# EAGLE design rgb_firefly_20090522_v2.3 (EAGLE 5.04)
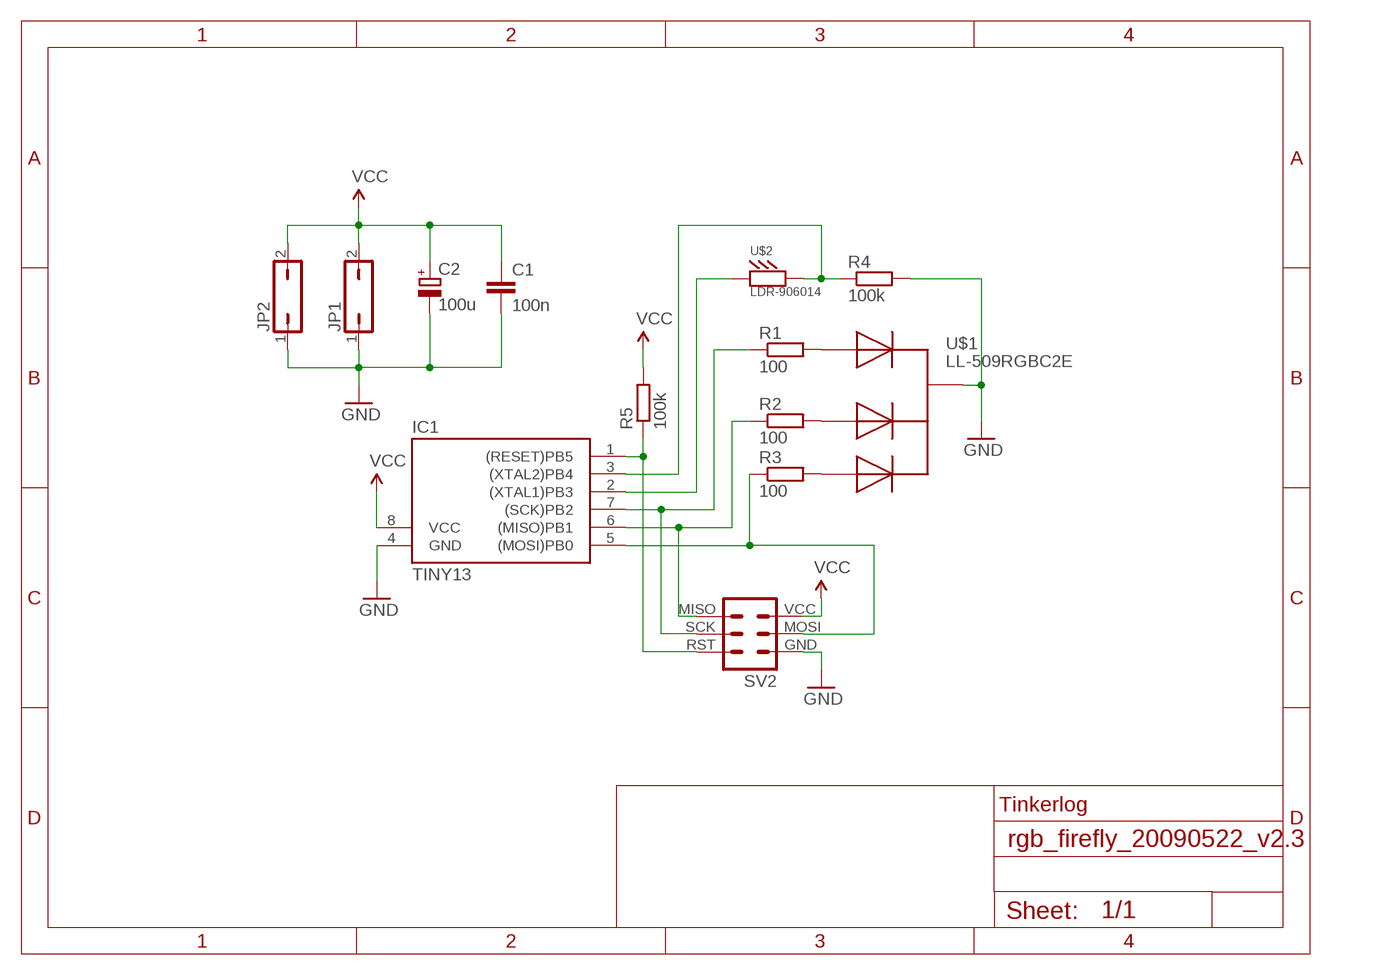
[diagram p0: schematic, sheet 1]

## Parts
C1  100n  C-EU025-025X050  [C025-025X050]
C2  100u  CPOL-EUE2,5-6E  [E2,5-6E]
IC1  TINY13  TINY12P  [DIL08]
JP1  JP1Q  [JP1]
JP2  JP1Q  [JP1]
R1  100  R-EU_0207/10  [0207/10]
R2  100  R-EU_0207/10  [0207/10]
R3  100  R-EU_0207/10  [0207/10]
R4  100k  R-EU_0207/10  [0207/10]
R5  100k  R-EU_0207/10  [0207/10]
SV2  MA03-2  [MA03-2]
U$1  LL-509RGBC2E  [LL-509RGBC2EB]
U$2  LDR-906014  [LDR-906014]

## Nets
GND: C1.2 C2.- IC1.4(GND) JP1.1 JP2.1 R4.2 SV2.GND U$1.P$4(GND)
N$1: R1.2 U$1.P$2(B)
N$2: R2.2 U$1.P$5(R)
N$3: R3.2 U$1.P$3(G)
N$6: IC1.2((XTAL1)PB3) U$2.P$1
N$7: IC1.5((MOSI)PB0) R3.1 SV2.MOSI
N$8: IC1.6((MISO)PB1) R2.1 SV2.MISO
N$9: IC1.7((SCK)PB2) R1.1 SV2.SCK
N$10: IC1.3((XTAL2)PB4) R4.1 U$2.P$2
N$12: IC1.1((RESET)PB5) R5.1 SV2.RST
VCC: C1.1 C2.+ IC1.8(VCC) JP1.2 JP2.2 R5.2 SV2.VCC

## Notes on the sheet
- Tinkerlog

## Library data of the parts
C1 = alex:C-EU: CAPACITOR, European symbol
C2 = rcl:CPOL-EU: POLARIZED CAPACITOR, European symbol
IC1 = atmel:TINY12*: MICROCONTROLLER 1 Kbytes FLASH 64 bytes EEPROM
JP1 JP2 = jumper:JP1Q: JUMPER
R1-R5 = alex:R-EU_: RESISTOR, European symbol
SV2 = alex:MA03-2: PIN HEADER
U$1 = alex:LL-509RGBC2E
U$2 = alex:LDR-906014

## Board
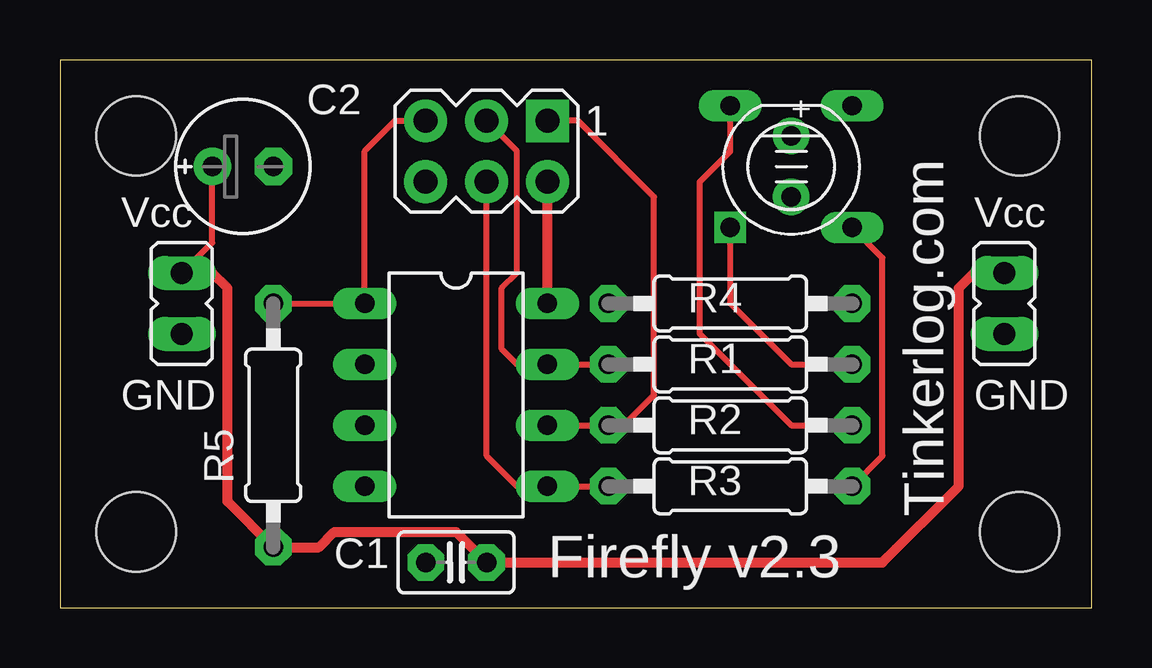
[diagram p1: board, top side]
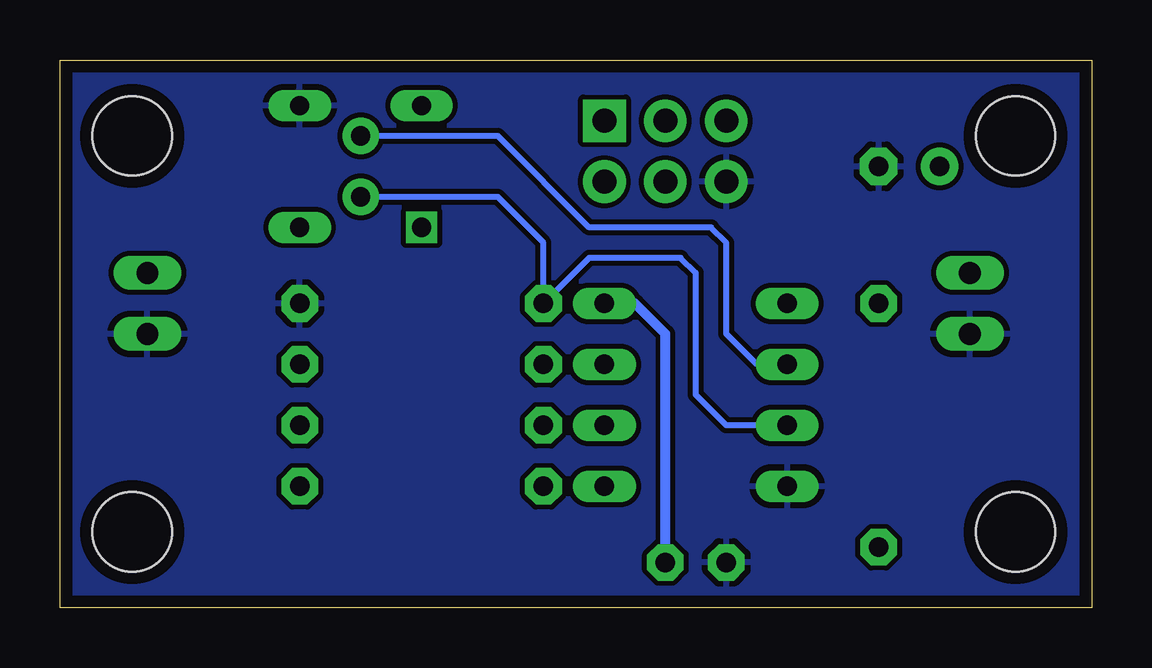
[diagram p2: board, bottom side, seen from below]

Size 43.02 x 22.85 mm. Coordinates in mm from the lower left corner, seen from the top.
Outline: 0,0 43.02,0 43.02,22.85 0.01,22.85 0,0
Copper layers (1*16): Top 0.035mm / dielectric 1.5mm / Bottom 0.035mm
Design rules "default *": minimum track width 10mil, minimum drill 24mil, track to track 8mil, track to pad 8mil, pad to pad 8mil, via to via 8mil, smd to smd 8mil, copper to edge 20mil, drill to drill 8mil, minimum pad ring 10mil, minimum via ring 8mil, stop-mask expansion 4mil, vias tented up to drill 0mil, thermal gap 10mil
Holes 3.3 mm at 3.18,19.68 3.18,3.17 40.01,3.17 40.01,19.68

### Footprints (pad centres in the part's own frame; a part is rotated, then mirrored left to right if it is on the bottom)
C025-025X050 = drill 0.813 pad 1.524 octagon: 1 -1.27,0; 2 1.27,0
E2,5-6E = drill 0.813 pad 1.575 round: + -1.27,0 | drill 0.813 pad 1.575 octagon: - 1.27,0
DIL08 = drill 0.813 long: 1 -3.81,-3.81; 2 -1.27,-3.81; 3 1.27,-3.81; 4 3.81,-3.81; 5 3.81,3.81; 6 1.27,3.81; 7 -1.27,3.81; 8 -3.81,3.81
JP1 = drill 0.914 long: 1 0,-1.27; 2 0,1.27
0207/10 = drill 0.813 pad 1.524 octagon: 1 -5.08,0; 2 5.08,0
MA03-2 = drill 1 pad 1.778 round: GND 2.54,1.27; MOSI 0,1.27; RST 2.54,-1.27; SCK 0,-1.27; VCC -2.54,1.27 | drill 1 pad 1.778 square: MISO -2.54,-1.27
LL-509RGBC2EB = drill 0.8 square: P$2 -2.54,-2.54 | drill 0.8 long: P$3 2.54,-2.54; P$4 2.54,2.54; P$5 -2.54,2.54
LDR-906014 = drill 0.8 pad 1.524 round: P$1 0,1.27; P$2 0,-1.27

### Placement (x,y rotation side)
C1  16.51,1.9 180 top
C2  7.62,18.41 0 top
IC1  16.51,8.88 270 top
JP1  5.08,12.69 0 top
JP2  39.37,12.69 0 top
R1  27.94,10.15 0 top
R2  27.94,7.62 0 top
R3  27.94,5.08 0 top
R4  27.94,12.69 0 top
R5  8.89,7.62 270 top
SV2  17.78,19.05 180 top
U$1  30.48,18.41 0 top
U$2  30.48,18.41 0 top

### Tracks (layer width: path | path; a pad name or v marks a point on that pad's centre or on a via)
GND
  pour Bottom: 0,22.86 0,-0.01 43.18,-0.01 43.18,22.86
N$1
  Top 0.254: R1.2 30.48,10.15 27.94,12.69 U$1.P$2
N$2
  Top 0.254: R2.2 30.48,7.62 26.67,11.42 26.67,17.78 27.94,19.05 U$1.P$5
N$3
  Top 0.254: R3.2 34.29,6.34 34.29,14.6 U$1.P$3
N$6
  Bottom 0.254: U$2.P$1 24.77,19.68 20.96,15.87 15.88,15.87 15.24,15.23 15.24,11.42 13.97,10.15 IC1.2
N$7
  Top 0.254: R3.1 IC1.5 19.05,5.08 17.78,6.34 SV2.MOSI
N$8
  Top 0.254: IC1.6 R2.1 23.5,7.62 24.77,8.88 24.77,17.14 21.59,20.32 SV2.MISO
N$9
  Top 0.254: R1.1 IC1.7 19.05,10.15 18.42,10.79 18.42,13.33 19.05,13.96 19.05,19.05 SV2.SCK
N$10
  Bottom 0.254: U$2.P$2 24.77,17.14 22.86,15.23 R4.1 20.96,14.6 17.15,14.6 16.51,13.96 16.51,8.88 15.24,7.62 IC1.3
N$12
  Top 0.254: R5.1 IC1.1 12.7,19.05 13.97,20.32 SV2.RST
VCC
  Top 0.254: JP1.2 6.35,15.23 C2.+
  Top 0.406: IC1.8 SV2.VCC | JP1.2 6.35,13.96 6.99,13.33 6.99,4.44 R5.2 10.8,2.54 11.43,3.17 16.51,3.17 C1.1 34.29,1.9 37.47,5.08 37.47,13.33 38.1,13.96 JP2.2
  Bottom 0.406: IC1.8 19.05,12.69 17.78,11.42 C1.1

### Text on the board
tPlace: + | Vcc | Vcc | GND | GND | Tinkerlog.com | Firefly v2.3